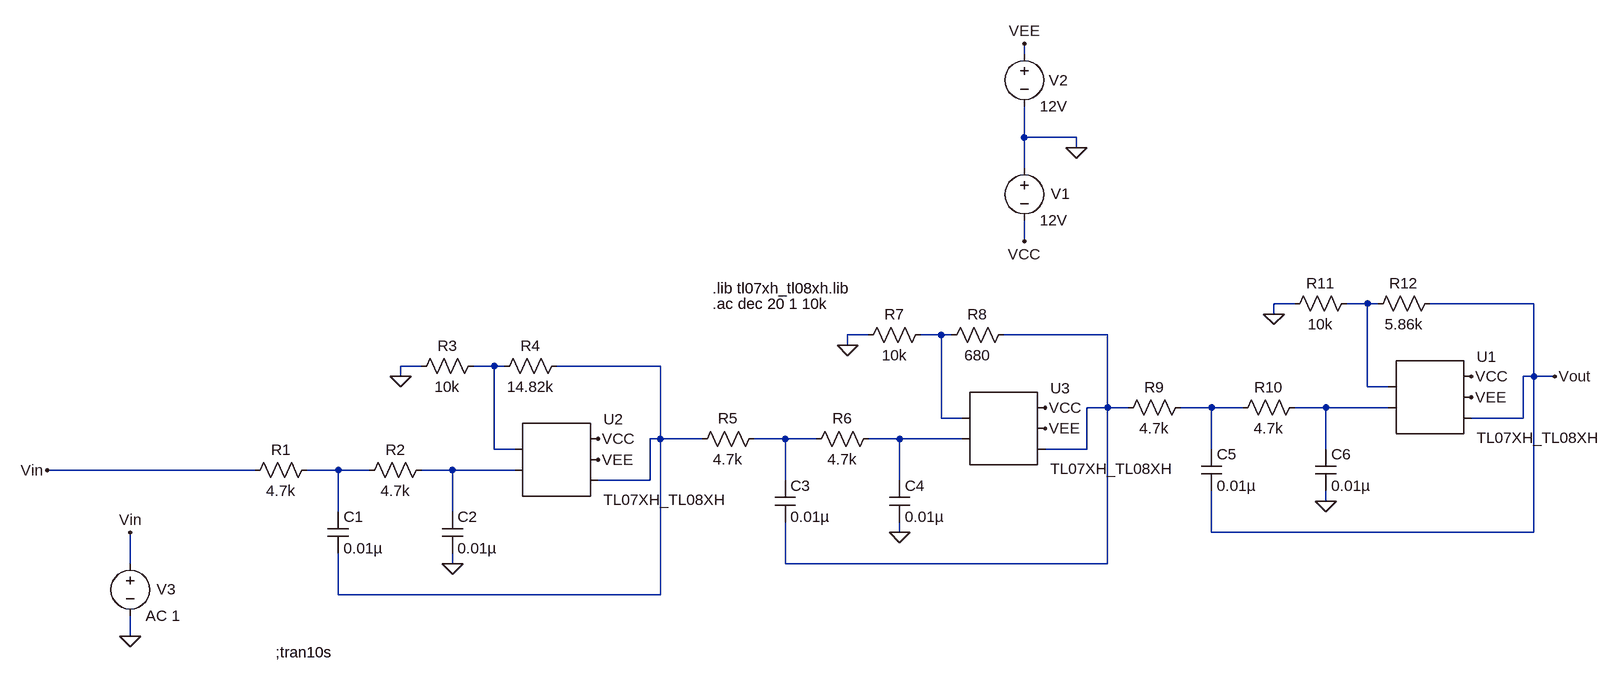
[diagram p0: schematic Design_Challenge - 6th Order - Using TL082.asc]
Design_Challenge - 6th Order - Using TL082.asc, the LTspice schematic file:
Version 4
SHEET 1 3956 1680
WIRE -256 -176 -256 -192
WIRE -256 -48 -256 -96
WIRE -176 -48 -256 -48
WIRE -176 -32 -176 -48
WIRE -256 0 -256 -48
WIRE -256 112 -256 80
WIRE 160 208 128 208
WIRE 272 208 240 208
WIRE 288 208 272 208
WIRE 528 208 368 208
WIRE 128 224 128 208
WIRE -496 256 -528 256
WIRE -384 256 -416 256
WIRE -368 256 -384 256
WIRE -128 256 -288 256
WIRE -528 272 -528 256
WIRE -1184 304 -1216 304
WIRE -1072 304 -1104 304
WIRE -1056 304 -1072 304
WIRE -816 304 -976 304
WIRE -1216 320 -1216 304
WIRE 528 320 528 208
WIRE 528 320 512 320
WIRE 560 320 528 320
WIRE 272 336 272 208
WIRE 304 336 272 336
WIRE -128 368 -128 256
WIRE -128 368 -160 368
WIRE -96 368 -128 368
WIRE 32 368 -16 368
WIRE 80 368 32 368
WIRE 208 368 160 368
WIRE 304 368 208 368
WIRE -384 384 -384 256
WIRE -352 384 -384 384
WIRE 512 384 512 320
WIRE 512 384 432 384
WIRE -816 416 -816 304
WIRE -816 416 -832 416
WIRE -752 416 -816 416
WIRE -624 416 -672 416
WIRE -576 416 -624 416
WIRE -448 416 -496 416
WIRE -352 416 -448 416
WIRE -1072 432 -1072 304
WIRE -1040 432 -1072 432
WIRE -160 432 -160 368
WIRE -160 432 -224 432
WIRE 32 432 32 368
WIRE 208 432 208 368
WIRE -1440 464 -1760 464
WIRE -1312 464 -1360 464
WIRE -1264 464 -1312 464
WIRE -1136 464 -1184 464
WIRE -1040 464 -1136 464
WIRE -832 480 -832 416
WIRE -832 480 -912 480
WIRE -624 480 -624 416
WIRE -448 480 -448 416
WIRE 208 512 208 496
WIRE -1312 528 -1312 464
WIRE -1136 528 -1136 464
WIRE -448 560 -448 544
WIRE 32 560 32 496
WIRE 528 560 528 320
WIRE 528 560 32 560
WIRE -1632 608 -1632 560
WIRE -1136 608 -1136 592
WIRE -624 608 -624 544
WIRE -128 608 -128 368
WIRE -128 608 -624 608
WIRE -1312 656 -1312 592
WIRE -816 656 -816 416
WIRE -816 656 -1312 656
WIRE -1632 720 -1632 688
FLAG -176 -32 0
FLAG -256 -192 VEE
FLAG 432 352 VEE
FLAG -256 112 VCC
FLAG 432 320 VCC
FLAG -1760 464 Vin
FLAG -1216 320 0
FLAG -1136 608 0
FLAG -528 272 0
FLAG -448 560 0
FLAG -1632 720 0
FLAG -1632 560 Vin
FLAG 560 320 Vout
FLAG 128 224 0
FLAG 208 512 0
FLAG -912 448 VEE
FLAG -912 416 VCC
FLAG -224 400 VEE
FLAG -224 368 VCC
SYMBOL voltage -256 -192 R0
WINDOW 0 38 56 Left 2
SYMATTR InstName V2
SYMATTR Value 12V
SYMBOL voltage -256 -16 R0
WINDOW 0 41 55 Left 2
SYMATTR InstName V1
SYMATTR Value 12V
SYMBOL res -1344 448 R90
WINDOW 0 0 56 VBottom 2
WINDOW 3 32 56 VTop 2
SYMATTR InstName R1
SYMATTR Value 4.7k
SYMBOL res -1168 448 R90
WINDOW 0 0 56 VBottom 2
WINDOW 3 32 56 VTop 2
SYMATTR InstName R2
SYMATTR Value 4.7k
SYMBOL res -1088 288 R90
WINDOW 0 0 56 VBottom 2
WINDOW 3 32 56 VTop 2
SYMATTR InstName R3
SYMATTR Value 10k
SYMBOL res -960 288 R90
WINDOW 0 0 56 VBottom 2
WINDOW 3 32 56 VTop 2
SYMATTR InstName R4
SYMATTR Value 14.82k
SYMBOL cap -1328 528 R0
SYMATTR InstName C1
SYMATTR Value 0.01µ
SYMBOL cap -1152 528 R0
SYMATTR InstName C2
SYMATTR Value 0.01µ
SYMBOL res -656 400 R90
WINDOW 0 0 56 VBottom 2
WINDOW 3 32 56 VTop 2
SYMATTR InstName R5
SYMATTR Value 4.7k
SYMBOL res -480 400 R90
WINDOW 0 0 56 VBottom 2
WINDOW 3 32 56 VTop 2
SYMATTR InstName R6
SYMATTR Value 4.7k
SYMBOL res -400 240 R90
WINDOW 0 0 56 VBottom 2
WINDOW 3 32 56 VTop 2
SYMATTR InstName R7
SYMATTR Value 10k
SYMBOL res -272 240 R90
WINDOW 0 0 56 VBottom 2
WINDOW 3 32 56 VTop 2
SYMATTR InstName R8
SYMATTR Value 680
SYMBOL cap -640 480 R0
SYMATTR InstName C3
SYMATTR Value 0.01µ
SYMBOL cap -464 480 R0
SYMATTR InstName C4
SYMATTR Value 0.01µ
SYMBOL voltage -1632 592 R0
WINDOW 0 41 55 Left 2
SYMATTR InstName V3
SYMATTR Value AC 1
SYMBOL res 0 352 R90
WINDOW 0 0 56 VBottom 2
WINDOW 3 32 56 VTop 2
SYMATTR InstName R9
SYMATTR Value 4.7k
SYMBOL res 176 352 R90
WINDOW 0 0 56 VBottom 2
WINDOW 3 32 56 VTop 2
SYMATTR InstName R10
SYMATTR Value 4.7k
SYMBOL res 256 192 R90
WINDOW 0 0 56 VBottom 2
WINDOW 3 32 56 VTop 2
SYMATTR InstName R11
SYMATTR Value 10k
SYMBOL res 384 192 R90
WINDOW 0 0 56 VBottom 2
WINDOW 3 32 56 VTop 2
SYMATTR InstName R12
SYMATTR Value 5.86k
SYMBOL cap 16 432 R0
SYMATTR InstName C5
SYMATTR Value 0.01µ
SYMBOL cap 192 432 R0
SYMATTR InstName C6
SYMATTR Value 0.01µ
SYMBOL AutoGenerated\\TL07XH_TL08XH 368 352 R0
SYMATTR InstName U1
SYMBOL AutoGenerated\\TL07XH_TL08XH -976 448 R0
SYMATTR InstName U2
SYMBOL AutoGenerated\\TL07XH_TL08XH -288 400 R0
SYMATTR InstName U3
TEXT -736 184 Left 2 !.lib tl07xh_tl08xh.lib
TEXT -736 208 Left 2 !.ac dec 20 1 10k
TEXT -1408 744 Left 2 !;tran10s

The netlist it stands for:
* Design_Challenge - 6th Order - Using TL082.asc
V2 VEE 0 12V
V1 0 VCC 12V
R1 N010 Vin 4.7k
R2 N011 N010 4.7k
R3 N004 0 10k
R4 N005 N004 14.82k
C1 N010 N005 0.01µ
C2 N011 0 0.01µ
R5 N008 N005 4.7k
R6 N009 N008 4.7k
R7 N002 0 10k
R8 N003 N002 680
C3 N008 N003 0.01µ
C4 N009 0 0.01µ
V3 Vin 0 AC 1
R9 N006 N003 4.7k
R10 N007 N006 4.7k
R11 N001 0 10k
R12 Vout N001 5.86k
C5 N006 Vout 0.01µ
C6 N007 0 0.01µ
* U1: TL07XH_TL08XH (symbol AutoGenerated\TL07XH_TL08XH not available, pins judged from their places): pin1=N001 pin2=N007 pin3=VCC pin4=VEE pin5=Vout
* U2: TL07XH_TL08XH (symbol AutoGenerated\TL07XH_TL08XH not available, pins judged from their places): pin1=N004 pin2=N011 pin3=VCC pin4=VEE pin5=N005
* U3: TL07XH_TL08XH (symbol AutoGenerated\TL07XH_TL08XH not available, pins judged from their places): pin1=N002 pin2=N009 pin3=VCC pin4=VEE pin5=N003
.lib tl07xh_tl08xh.lib
.ac dec 20 1 10k
;tran10s
.backanno
.end